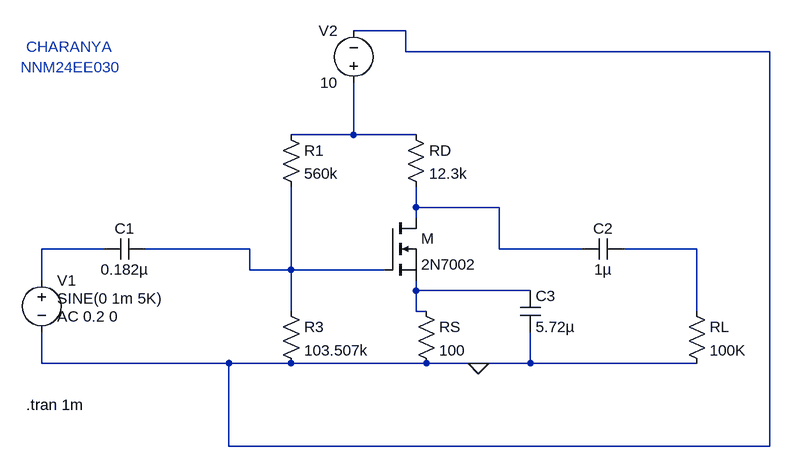
[diagram p0: schematic NNM24EE030_Charanya.asc]
NNM24EE030_Charanya.asc, the LTspice schematic file:
Version 4.1
SHEET 1 880 680
WIRE -1200 -752 -1280 -752
WIRE -1200 -720 -1200 -752
WIRE -640 -720 -1200 -720
WIRE -1280 -592 -1280 -672
WIRE -1280 -592 -1376 -592
WIRE -1184 -592 -1280 -592
WIRE -1184 -480 -1184 -512
WIRE -1056 -480 -1184 -480
WIRE -1184 -464 -1184 -480
WIRE -1664 -416 -1760 -416
WIRE -1440 -416 -1600 -416
WIRE -1056 -416 -1056 -480
WIRE -928 -416 -1056 -416
WIRE -752 -416 -864 -416
WIRE -1440 -384 -1440 -416
WIRE -1376 -384 -1376 -512
WIRE -1376 -384 -1440 -384
WIRE -1232 -384 -1376 -384
WIRE -1760 -368 -1760 -416
WIRE -1184 -352 -1184 -368
WIRE -1008 -352 -1184 -352
WIRE -1376 -320 -1376 -384
WIRE -1184 -320 -1184 -352
WIRE -1168 -320 -1184 -320
WIRE -752 -320 -752 -416
WIRE -1760 -240 -1760 -288
WIRE -1472 -240 -1760 -240
WIRE -1376 -240 -1472 -240
WIRE -1168 -240 -1376 -240
WIRE -1088 -240 -1168 -240
WIRE -1008 -240 -1008 -288
WIRE -1008 -240 -1088 -240
WIRE -752 -240 -1008 -240
WIRE -1472 -112 -1472 -240
WIRE -640 -112 -640 -720
WIRE -640 -112 -1472 -112
FLAG -1088 -240 0
SYMBOL cap -1600 -432 R90
WINDOW 0 0 32 VBottom 2
WINDOW 3 32 32 VTop 2
SYMATTR InstName C1
SYMATTR Value 0.182µ
SYMBOL cap -864 -432 R90
WINDOW 0 0 32 VBottom 2
WINDOW 3 32 32 VTop 2
SYMATTR InstName C2
SYMATTR Value 1µ
SYMBOL res -1392 -608 R0
SYMATTR InstName R1
SYMATTR Value 560k
SYMBOL res -1200 -608 R0
SYMATTR InstName RD
SYMATTR Value 12.3k
SYMBOL res -1392 -336 R0
SYMATTR InstName R3
SYMATTR Value 103.507k
SYMBOL res -1184 -336 R0
SYMATTR InstName RS
SYMATTR Value 100
SYMBOL nmos -1232 -464 R0
SYMATTR InstName M
SYMATTR Value 2N7002
SYMBOL res -768 -336 R0
SYMATTR InstName RL
SYMATTR Value 100K
SYMBOL voltage -1760 -384 R0
WINDOW 3 24 44 Left 2
WINDOW 123 24 72 Left 2
WINDOW 39 0 0 Left 0
SYMATTR Value SINE(0 1m 5K)
SYMATTR Value2 AC 0.2 0
SYMATTR InstName V1
SYMBOL voltage -1280 -656 R180
WINDOW 0 24 96 Left 2
WINDOW 3 24 16 Left 2
WINDOW 123 0 0 Left 0
WINDOW 39 0 0 Left 0
SYMATTR InstName V2
SYMATTR Value 10
SYMBOL cap -1024 -352 R0
SYMATTR InstName C3
SYMATTR Value 5.72µ
TEXT -1784 -176 Left 2 !.tran 1m
TEXT -1784 -728 Left 2 ;CHARANYA
TEXT -1792 -696 Left 2 ;NNM24EE030

The netlist it stands for:
* NNM24EE030_Charanya.asc
C1 N004 N003 0.182µ
C2 N005 N002 1µ
R1 N001 N004 560k
RD N001 N002 12.3k
R3 N004 0 103.507k
RS N006 0 100
M N002 N004 N006 N006 2N7002
RL N005 0 100K
V1 N003 0 SINE(0 1m 5K) AC 0.2 0
V2 N001 0 10
C3 N006 0 5.72µ
.model NMOS NMOS
.model PMOS PMOS
.lib standard.mos
.tran 1m
* CHARANYA
* NNM24EE030
.backanno
.end